# EAGLE design Breakout UVC (EAGLE 9.4.2)
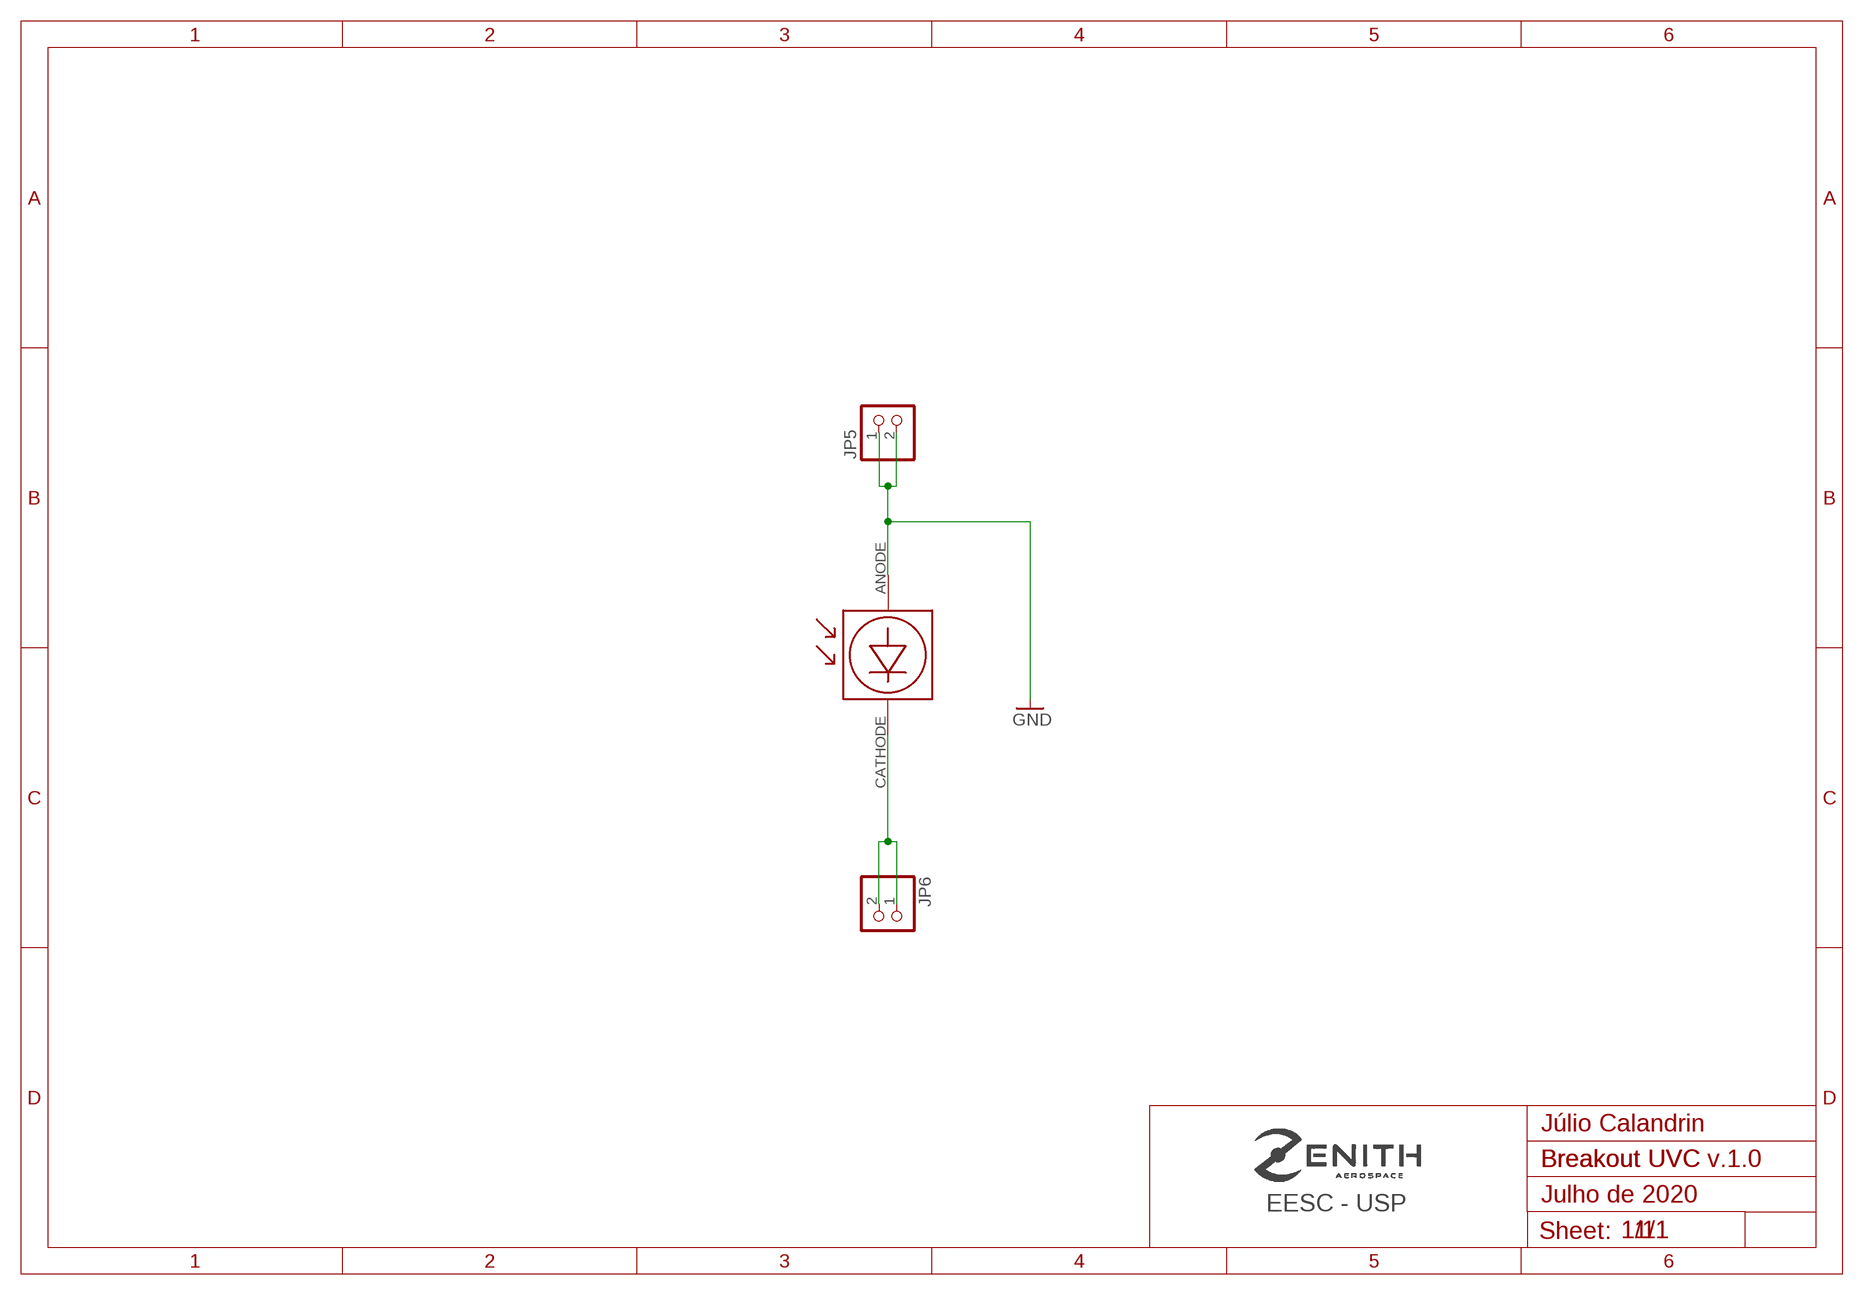
[diagram p0: schematic, sheet 1]

## Parts
JP5  PINHD-1X2  [1X02]
JP6  PINHD-1X2  [1X02]
U$1  GUVC-S10GD  [GUV_C]

## Nets
GND: JP5.1 JP5.2 U$1.ANODE
N$2: JP6.1 JP6.2 U$1.CATHODE

## Notes on the sheet
- Júlio Calandrin
- Breakout UVC v.1.0
- EESC - USP | Julho de 2020
- 1/1

## Library data of the parts
JP5 JP6 = pinhead(1x3):PINHD-1X2: PIN HEADER
U$1 = GUVX:GUVC-S10GD

## Board
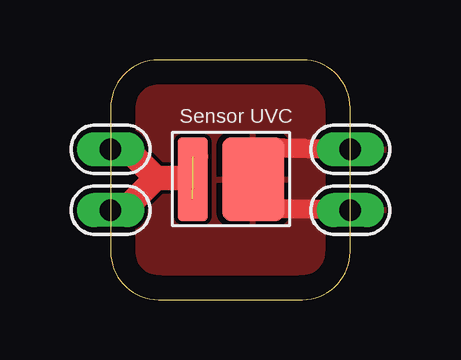
[diagram p1: board, top side]
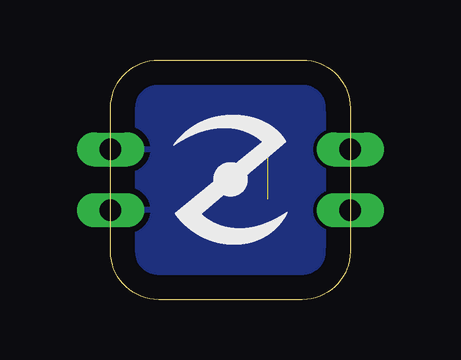
[diagram p2: board, bottom side, seen from below]

Size 10 x 10 mm. Coordinates in mm from the lower left corner, seen from the top.
Outline: 0,8 0,2 arc90 2,0 8,0 arc90 10,2 10,8 arc90 8,10 2,10 arc90 0,8
Copper layers (1*16): Top 0.035mm / dielectric 1.5mm / Bottom 0.035mm
Design rules "default": minimum track width 6mil, minimum drill 0.35mm, track to track 6mil, track to pad 6mil, pad to pad 6mil, via to via 6mil, smd to smd 6mil, copper to edge 40mil, drill to drill 6mil, minimum pad ring 10mil, minimum via ring 8mil, stop-mask expansion 4mil, vias tented up to drill 0mil, thermal gap 10mil

### Footprints (pad centres in the part's own frame; a part is rotated, then mirrored left to right if it is on the bottom)
1X02 = drill 0.9 pad 1.2 long: 1 -1.27,0; 2 1.27,0
GUV_C = smd 2.576 x 3.5: ANODE 3.378,1.93 | smd 1.276 x 3.5: CATHODE 0.861,1.93

### Placement (x,y rotation side)
JP5  10,5 90 top
JP6  0,5 90 top
U$1  2.57,3.09 0 top

### Tracks (layer width: path | path; a pad name or v marks a point on that pad's centre or on a via)
GND
  Top 0.813: JP5.1 6.35,3.81 | JP5.2 6.35,6.35
  Top 1.016: JP5.2 9.65,6.35 | JP5.1 9.65,3.81
  pour Top: -1.27,11.43 -1.27,-1.27 11.43,-1.27 11.43,11.43
  pour Bottom: -1,11 -1,-1 11,-1 11,11
N$2  (2 unrouted)
  Top 1.016: JP6.2 0.64,6.35 1.91,5.08 | JP6.1 0.64,3.81 1.91,5.08 | 3.43,5.97 3.56,5.97 | 3.43,4.19 | 1.91,5.08 3.37,5.08 U$1.CATHODE

### Text on the board
tNames: Sensor UVC